# Altium schematic sheet ADCAN_[sch1].SchDoc: ADCAN
size A4; Author: Marta Basquens; SheetNumber: 1; SheetTotal: 2; University: UPC EEBE; City&Country: Barcelona Spain; Country: NSW; CP: 08019; DesignerName: Marta Basquens; Address: Av. Eduard Maristany, 16
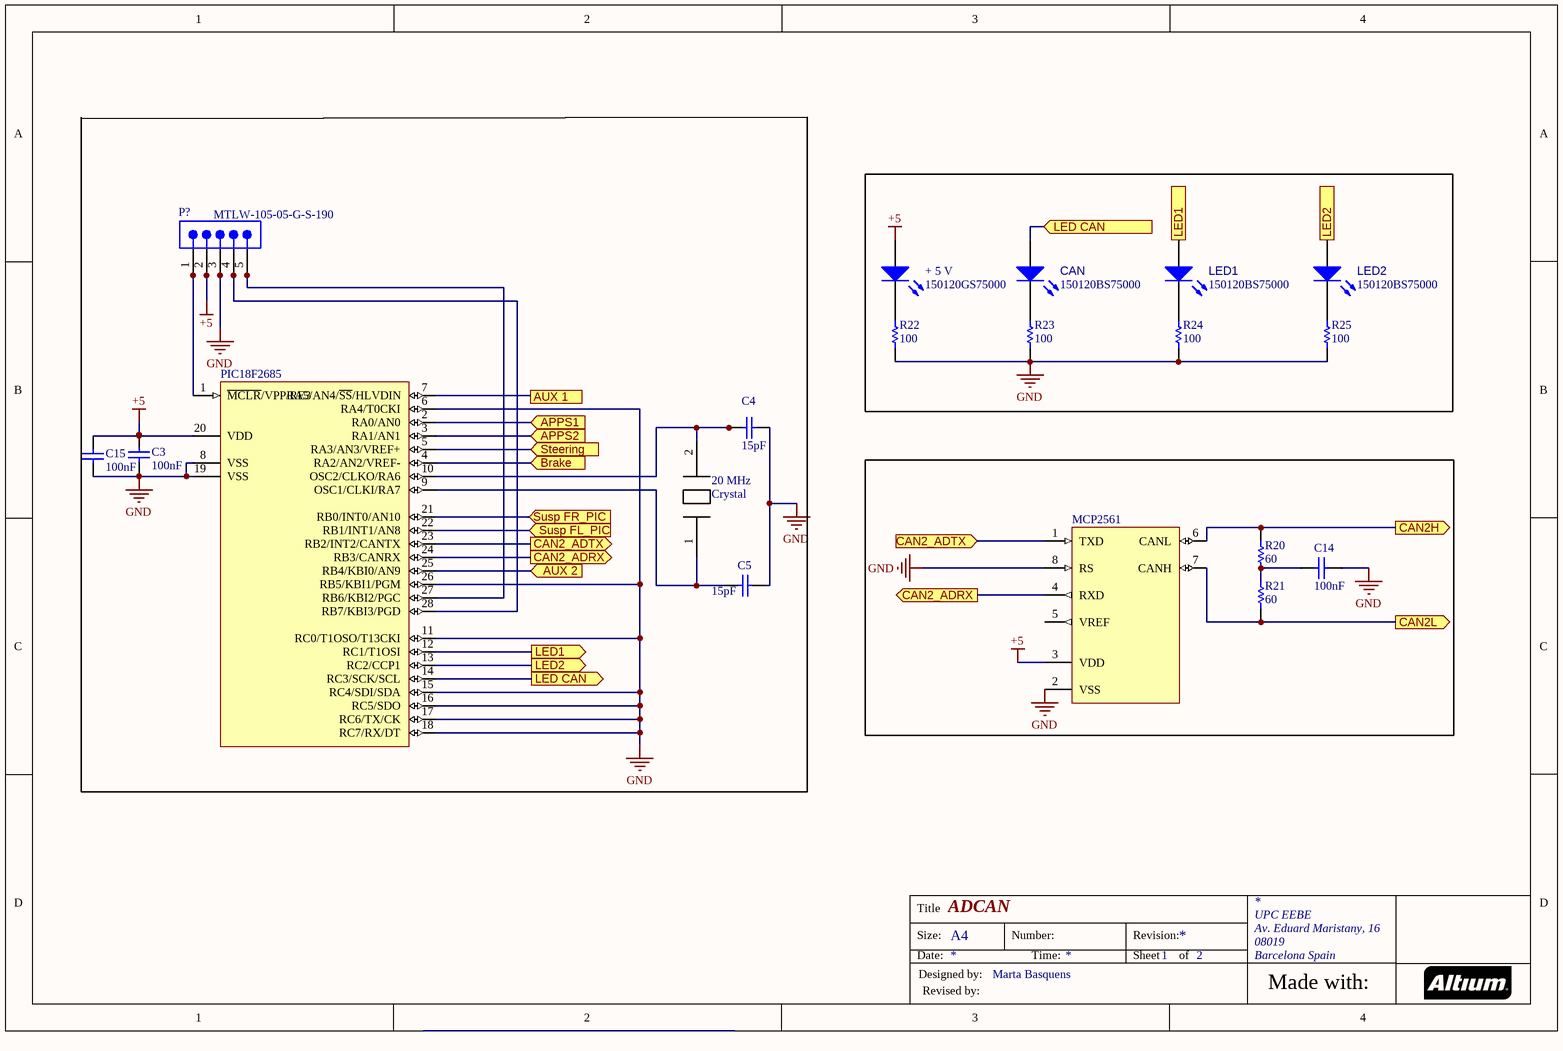
[diagram p0: ADCAN_[sch1].SchDoc]

## Parts
20_MHz  Crystal  [Crystal]
+_5_V  150120GS75000  [1206_A]
C3  100nF  [CAPC3216X102X94LL20]
C4  15pF  [CAPC1206(3216)100_L]
C5  15pF  [CAPC1206(3216)100_L]
C14  100nF  [CAPC3216X102X94LL20]
C15  100nF  [CAPC3216X102X94LL20]
CAN  150120BS75000  [1206_A]
LED1  150120BS75000  [1206_A]
LED2  150120BS75000  [1206_A]
MCP2561  (no value)  [SOIC-SN8_N]
P?  MTLW-105-05-G-S-190  [SMTC-MTLW-105-05-X-S-190]
PIC18F2685  (no value)  [SOIC-SO28_M]
R20  60  [RESC1206(3216)_L]
R21  60  [RESC1206(3216)_L]
R22  100  [RESC1206(3216)_L]
R23  100  [RESC1206(3216)_L]
R24  100  [RESC1206(3216)_L]
R25  100  [RESC1206(3216)_L]

## Ports
APPS1 (in), APPS2 (in), AUX 1 (in), AUX 2 (in), Brake (in), CAN2_ADRX (out), CAN2_ADTX (in), CAN2_ADTX (out), CAN2H (out), CAN2L (out), LED1 (in), LED1 (out), LED2 (in), LED2 (out), LED CAN (in), LED CAN (out), Steering (in), Susp FL_PIC (in), Susp FR_PIC (in)

## Nets
+5: +_5_V.2(A) C3.2 C15.2 MCP2561.3(VDD) P?.2 PIC18F2685.20(VDD)
GND: C4.2 C5.2 C14.2 C15.1 MCP2561.2(VSS) MCP2561.8(RS) P?.3 PIC18F2685.6(RA4/T0CKI) PIC18F2685.8(VSS) PIC18F2685.11(RC0/T1OSO/T13CKI) PIC18F2685.15(RC4/SDI/SDA) PIC18F2685.16(RC5/SDO) PIC18F2685.17(RC6/TX/CK) PIC18F2685.18(RC7/RX/DT) PIC18F2685.19(VSS) PIC18F2685.26(RB5/KBI1/PGM) R22.1 R23.1 R24.1 R25.1
APPS1: PIC18F2685.2(RA0/AN0) ; port APPS1
APPS2: PIC18F2685.3(RA1/AN1) ; port APPS2
AUX 2: PIC18F2685.25(RB4/KBI0/AN9) ; port AUX 2
Brake: PIC18F2685.4(RA2/AN2/VREF-) ; port Brake
CAN2_ADRX: MCP2561.4(RXD) PIC18F2685.24(RB3/CANRX) ; port CAN2_ADRX
CAN2_ADTX: MCP2561.1(TXD) PIC18F2685.23(RB2/INT2/CANTX) ; port CAN2_ADTX
CAN2H: MCP2561.6(CANL) R20.2 ; port CAN2H
CAN2L: MCP2561.7(CANH) R21.1 ; port CAN2L
LED1: LED1.2(A) PIC18F2685.12(RC1/T1OSI) ; port LED1
LED2: LED2.2(A) PIC18F2685.13(RC2/CCP1) ; port LED2
LED CAN: CAN.2(A) PIC18F2685.14(RC3/SCK/SCL) ; port LED CAN
Steering: PIC18F2685.5(RA3/AN3/VREF+) ; port Steering
Susp FL_PIC: PIC18F2685.22(RB1/INT1/AN8) ; port Susp FL_PIC
Susp FR_PIC: PIC18F2685.21(RB0/INT0/AN10) ; port Susp FR_PIC
Net+_5_V_1: +_5_V.1(K) R22.2
NetC4_1: C4.1 PIC18F2685.10(OSC2/CLKO/RA6)
NetC5_1: C5.1 PIC18F2685.9(OSC1/CLKI/RA7)
NetC14_1: C14.1 R20.1 R21.2
NetCAN_1: CAN.1(K) R23.2
NetLED1_1: LED1.1(K) R24.2
NetLED2_1: LED2.1(K) R25.2
NetP?_1: P?.1 PIC18F2685.1(~{MCLR}/VPP/RE3)
NetP?_4: P?.4 PIC18F2685.28(RB7/KBI3/PGD)
NetP?_5: P?.5 PIC18F2685.27(RB6/KBI2/PGC)

Not connected (* = marked no-connect by the designer): 20_MHz 1 2; C3 1; MCP2561 5(VREF); PIC18F2685 7(RA5/AN4/~{SS}/HLVDIN)

## Notes on the sheet
- Title
- Size:
- Date:
- Designed by:
- A4
- Number:
- Time:
- Revision:
- Sheet
- of
- Made with:
- Revised by:

## Library data of the parts
+_5_V = CMP-1426-00014-1: SMD mono-color Chip LED, WL-SMCW, Green; Manufacturer: Wuerth Elektronik; PackageReference: 1206_A; PartNumber: 150120GS75000; ComponentLink1Description: Manufacturer URL; ComponentLink2URL: http://katalog.we-online.com/led/datasheet/150120GS75000.pdf; ComponentLink2Description: Datasheet; Color: Green; ComponentLink1URL: http://www.we-online.com
C3 C14 C15 = CMP-2000-07385-1: Chip Capacitor, 1.05 nF, +/- 12%, 14 V, -55 to 125 degC, 1206 (3216 Metric), RoHS, Tape and Reel; Manufacturer: AVX; Brand/Series: TransGuard®; Current, Reverse, Maximum: 15 / µA; Type: TVS; Standards: ULListed; Capacitance: 1050 / pF; Energy Rating: 0.4 / Joules; Voltage, Working: 14/10 / VDC/VAC; Suppressor Type: Voltage; For Use With: IndustrialEquipment; Temperature, Junction, Maximum: +125 / °C; Configuration: Bidirectional; Current, Ratings: 150 / A; Voltage, Operating: 10/14 / VAC/VDC; Primary Type: Diodes; Voltage, Breakdown: 18.5 / V; Clamping Voltage: 32 / V; Temperature, Junction, Minimum: –55 / °C; Termination: Leadwires; Mounting Type: Thru-Hole; Current, Leakage: 15 / µA; Package Type: 1206; Current, Leakage, Maximum: 15 / µA; Manufacturer URL: http://www.avx.com/; Dimensions: 3.2Lx1.6Wx0.94T / mm; Package Reference: 1206; Datasheet URL: http://datasheets.avx.com/tguard.pdf; Current, Surge: 150 / A; Mounting Technology: SurfaceMount; Voltage, Clamping: 32 / V; Datasheet Version: 08/2016; Package Description: 2-Pin Surface Mount Device, Body 3.2 x 1.6 mm
C4 C5 = CMP-1037-00790-1: CAP 15pF 16V ±10% 1206 (3216 Metric) Thickness 1mm SMD; Tolerance: Â±10%; Case-Metric: 3216; Case-EIA: 1206; Technology: SMT; Rated Voltage: 16 V; Value: 15pF; Max Thickness: 1 mm
CAN LED1 LED2 = CMP-1426-00015-1: SMD mono-color Chip LED, WL-SMCW, Blue; Manufacturer: Wuerth Elektronik; ComponentLink2Description: Datasheet; ComponentLink1URL: http://www.we-online.com; PartNumber: 150120BS75000; ComponentLink1Description: Manufacturer URL; ComponentLink2URL: http://katalog.we-online.com/led/datasheet/150120BS75000.pdf; PackageReference: 1206_A; Color: Blue
MCP2561 = CMP-0186-00138-2: High-Speed CAN Transceiver, 8-Pin SOIC, Industrial Temperature; Code_JEDEC: MS-012; ComponentLink3URL: http://www.microchip.com/stellent/groups/techpub_sg/documents/packagingspec/en012702.pdf; DatasheetVersion: revF, Jul-2010; PackageVersion: revBB, Aug-2009; PackageDescription: 8-Lead Plastic Small Outline (SN) - Narrow, 3.90mm Body [SOIC]; ComponentLink1URL: http://www.microchip.com/; ComponentLink3Description: Package Specification; ComponentLink2Description: Datasheet; Code_IPC: SOIC127P600-8; ComponentLink1Description: Manufacturer URL; PackageReference: SOIC-SN8; ComponentLink2URL: http://ww1.microchip.com/downloads/en/DeviceDoc/21667F.pdf; RevisionNote: URLs added. DatasheetVersion updated.
P? = CMP-1024-00076-1: Manufacturer: Samtec; Pitch: 2.54 mm; ComponentLink3Description: Package Specification; ComponentLink1Description: Manufacturer URL; ComponentLink1URL: http://www.samtec.com; PartNumber: MTLW-105-05-G-S-190; Mounting Technology: Through-hole; Orientation: Vertical; ComponentLink3URL: http://www.samtec.com/documents/webfiles/cpdf/MTLW-1XX-XX-XX-X-XXX-XX-XX-MKT1.pdf; PackageReference: MTLW-105-05-X-S-190; ComponentLink2URL: http://www.samtec.com/documents/webfiles/pdf/MTLW_TH.PDF; ComponentLink2Description: Datasheet; PackageDescription: Low Profile Terminal Assembly; Temperature Range: -55 to 125 degC; DatasheetVersion: F-214; RoHS: True; PackageVersion: T, 6/1991
PIC18F2685 = CMP-0116-01073-1: Enhanced Flash Microcontroller with ECAN Technology, 10-Bit A/D and nanoWatt Technology, 96K Flash, 28-Pin SOIC, Extended Temperature Range, Tape and Reel; ComponentAvailability: Unknown. Contact manufacturer to determine status.; PackageDescription: 28-Lead Plastic Small Outline (SO) - Wide 7.50mm Body [SOIC]; DatasheetVersion: revC, Oct-2009; PackageVersion: revBB, Aug-2009; Code_JEDEC: MS-013; PackageReference: SOIC-SO28
R20 R21 = CMP-1014-00532-1: 1K62 0.25W 1% 1206 (3216 Metric)  SMD; Case-Metric: 3216; Value: 1620.00 Ohm; Case-EIA: 1206; Technology: SMT; Power: 0.25 W; Tolerance: 1 %
R22-R25 = CMP-1014-00659-1: 22K 0.25W 1% 1206 (3216 Metric)  SMD; Value: 22000.00 Ohm; Case-EIA: 1206; Case-Metric: 3216; Technology: SMT; Tolerance: 1 %; Power: 0.25 W